# Altium project testrack_backplane_passive.PrjPcb
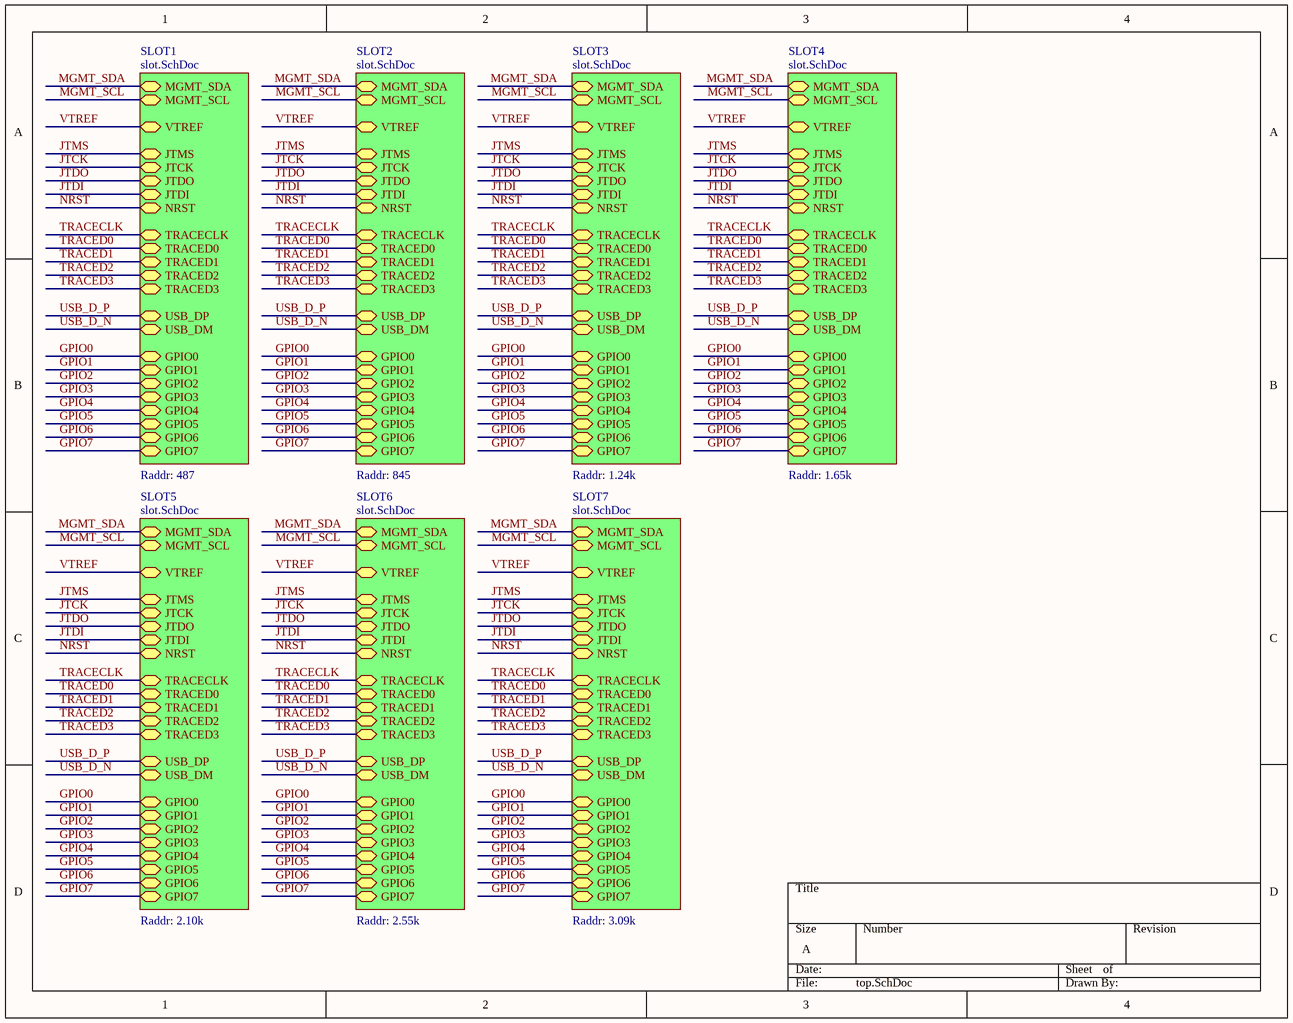
[diagram p0: top.SchDoc]
2 sheets, 14 parts. Net scope: hierarchical (ports join the sheet entries above them; power ports are global).
Board file: testrack_backplane_passive.PcbDoc
Sheets:
  top.SchDoc
    SLOT1 = slot.SchDoc
    SLOT2 = slot.SchDoc
    SLOT3 = slot.SchDoc
    SLOT4 = slot.SchDoc
    SLOT5 = slot.SchDoc
    SLOT6 = slot.SchDoc
    SLOT7 = slot.SchDoc

## Sheet top.SchDoc
size A

### Sub-sheets
SLOT1 = slot.SchDoc: JTCK (bidir), GPIO1 (bidir), GPIO0 (bidir), TRACED0 (bidir), GPIO6 (bidir), USB_DP (bidir), NRST (bidir), USB_DM (bidir), MGMT_SDA (bidir), GPIO5 (bidir), JTDO (bidir), GPIO7 (bidir), GPIO3 (bidir), VTREF (bidir), TRACED2 (bidir), GPIO2 (bidir), TRACECLK (bidir), GPIO4 (bidir), MGMT_SCL (bidir), JTMS (bidir), TRACED3 (bidir), TRACED1 (bidir), JTDI (bidir)  | Raddr: 487
SLOT2 = slot.SchDoc: JTCK (bidir), GPIO1 (bidir), GPIO0 (bidir), TRACED0 (bidir), GPIO6 (bidir), USB_DP (bidir), NRST (bidir), USB_DM (bidir), MGMT_SDA (bidir), GPIO5 (bidir), JTDO (bidir), GPIO7 (bidir), GPIO3 (bidir), VTREF (bidir), TRACED2 (bidir), GPIO2 (bidir), TRACECLK (bidir), GPIO4 (bidir), MGMT_SCL (bidir), JTMS (bidir), TRACED3 (bidir), TRACED1 (bidir), JTDI (bidir)  | Raddr: 845
SLOT3 = slot.SchDoc: JTCK (bidir), GPIO1 (bidir), GPIO0 (bidir), TRACED0 (bidir), GPIO6 (bidir), USB_DP (bidir), NRST (bidir), USB_DM (bidir), MGMT_SDA (bidir), GPIO5 (bidir), JTDO (bidir), GPIO7 (bidir), GPIO3 (bidir), VTREF (bidir), TRACED2 (bidir), GPIO2 (bidir), TRACECLK (bidir), GPIO4 (bidir), MGMT_SCL (bidir), JTMS (bidir), TRACED3 (bidir), TRACED1 (bidir), JTDI (bidir)  | Raddr: 1.24k
SLOT4 = slot.SchDoc: JTCK (bidir), GPIO1 (bidir), GPIO0 (bidir), TRACED0 (bidir), GPIO6 (bidir), USB_DP (bidir), NRST (bidir), USB_DM (bidir), MGMT_SDA (bidir), GPIO5 (bidir), JTDO (bidir), GPIO7 (bidir), GPIO3 (bidir), VTREF (bidir), TRACED2 (bidir), GPIO2 (bidir), TRACECLK (bidir), GPIO4 (bidir), MGMT_SCL (bidir), JTMS (bidir), TRACED3 (bidir), TRACED1 (bidir), JTDI (bidir)  | Raddr: 1.65k
SLOT5 = slot.SchDoc: JTCK (bidir), GPIO1 (bidir), GPIO0 (bidir), TRACED0 (bidir), GPIO6 (bidir), USB_DP (bidir), NRST (bidir), USB_DM (bidir), MGMT_SDA (bidir), GPIO5 (bidir), JTDO (bidir), GPIO7 (bidir), GPIO3 (bidir), VTREF (bidir), TRACED2 (bidir), GPIO2 (bidir), TRACECLK (bidir), GPIO4 (bidir), MGMT_SCL (bidir), JTMS (bidir), TRACED3 (bidir), TRACED1 (bidir), JTDI (bidir)  | Raddr: 2.10k
SLOT6 = slot.SchDoc: JTCK (bidir), GPIO1 (bidir), GPIO0 (bidir), TRACED0 (bidir), GPIO6 (bidir), USB_DP (bidir), NRST (bidir), USB_DM (bidir), MGMT_SDA (bidir), GPIO5 (bidir), JTDO (bidir), GPIO7 (bidir), GPIO3 (bidir), VTREF (bidir), TRACED2 (bidir), GPIO2 (bidir), TRACECLK (bidir), GPIO4 (bidir), MGMT_SCL (bidir), JTMS (bidir), TRACED3 (bidir), TRACED1 (bidir), JTDI (bidir)  | Raddr: 2.55k
SLOT7 = slot.SchDoc: JTCK (bidir), GPIO1 (bidir), GPIO0 (bidir), TRACED0 (bidir), GPIO6 (bidir), USB_DP (bidir), NRST (bidir), USB_DM (bidir), MGMT_SDA (bidir), GPIO5 (bidir), JTDO (bidir), GPIO7 (bidir), GPIO3 (bidir), VTREF (bidir), TRACED2 (bidir), GPIO2 (bidir), TRACECLK (bidir), GPIO4 (bidir), MGMT_SCL (bidir), JTMS (bidir), TRACED3 (bidir), TRACED1 (bidir), JTDI (bidir)  | Raddr: 3.09k

### Nets
GPIO0: sheet SLOT1/GPIO0, sheet SLOT2/GPIO0, sheet SLOT3/GPIO0, sheet SLOT4/GPIO0, sheet SLOT5/GPIO0, sheet SLOT6/GPIO0, sheet SLOT7/GPIO0
GPIO1: sheet SLOT1/GPIO1, sheet SLOT2/GPIO1, sheet SLOT3/GPIO1, sheet SLOT4/GPIO1, sheet SLOT5/GPIO1, sheet SLOT6/GPIO1, sheet SLOT7/GPIO1
GPIO2: sheet SLOT1/GPIO2, sheet SLOT2/GPIO2, sheet SLOT3/GPIO2, sheet SLOT4/GPIO2, sheet SLOT5/GPIO2, sheet SLOT6/GPIO2, sheet SLOT7/GPIO2
GPIO3: sheet SLOT1/GPIO3, sheet SLOT2/GPIO3, sheet SLOT3/GPIO3, sheet SLOT4/GPIO3, sheet SLOT5/GPIO3, sheet SLOT6/GPIO3, sheet SLOT7/GPIO3
GPIO4: sheet SLOT1/GPIO4, sheet SLOT2/GPIO4, sheet SLOT3/GPIO4, sheet SLOT4/GPIO4, sheet SLOT5/GPIO4, sheet SLOT6/GPIO4, sheet SLOT7/GPIO4
GPIO5: sheet SLOT1/GPIO5, sheet SLOT2/GPIO5, sheet SLOT3/GPIO5, sheet SLOT4/GPIO5, sheet SLOT5/GPIO5, sheet SLOT6/GPIO5, sheet SLOT7/GPIO5
GPIO6: sheet SLOT1/GPIO6, sheet SLOT2/GPIO6, sheet SLOT3/GPIO6, sheet SLOT4/GPIO6, sheet SLOT5/GPIO6, sheet SLOT6/GPIO6, sheet SLOT7/GPIO6
GPIO7: sheet SLOT1/GPIO7, sheet SLOT2/GPIO7, sheet SLOT3/GPIO7, sheet SLOT4/GPIO7, sheet SLOT5/GPIO7, sheet SLOT6/GPIO7, sheet SLOT7/GPIO7
JTCK: sheet SLOT1/JTCK, sheet SLOT2/JTCK, sheet SLOT3/JTCK, sheet SLOT4/JTCK, sheet SLOT5/JTCK, sheet SLOT6/JTCK, sheet SLOT7/JTCK
JTDI: sheet SLOT1/JTDI, sheet SLOT2/JTDI, sheet SLOT3/JTDI, sheet SLOT4/JTDI, sheet SLOT5/JTDI, sheet SLOT6/JTDI, sheet SLOT7/JTDI
JTDO: sheet SLOT1/JTDO, sheet SLOT2/JTDO, sheet SLOT3/JTDO, sheet SLOT4/JTDO, sheet SLOT5/JTDO, sheet SLOT6/JTDO, sheet SLOT7/JTDO
JTMS: sheet SLOT1/JTMS, sheet SLOT2/JTMS, sheet SLOT3/JTMS, sheet SLOT4/JTMS, sheet SLOT5/JTMS, sheet SLOT6/JTMS, sheet SLOT7/JTMS
MGMT_SCL: sheet SLOT1/MGMT_SCL, sheet SLOT2/MGMT_SCL, sheet SLOT3/MGMT_SCL, sheet SLOT4/MGMT_SCL, sheet SLOT5/MGMT_SCL, sheet SLOT6/MGMT_SCL, sheet SLOT7/MGMT_SCL
MGMT_SDA: sheet SLOT1/MGMT_SDA, sheet SLOT2/MGMT_SDA, sheet SLOT3/MGMT_SDA, sheet SLOT4/MGMT_SDA, sheet SLOT5/MGMT_SDA, sheet SLOT6/MGMT_SDA, sheet SLOT7/MGMT_SDA
NRST: sheet SLOT1/NRST, sheet SLOT2/NRST, sheet SLOT3/NRST, sheet SLOT4/NRST, sheet SLOT5/NRST, sheet SLOT6/NRST, sheet SLOT7/NRST
TRACECLK: sheet SLOT1/TRACECLK, sheet SLOT2/TRACECLK, sheet SLOT3/TRACECLK, sheet SLOT4/TRACECLK, sheet SLOT5/TRACECLK, sheet SLOT6/TRACECLK, sheet SLOT7/TRACECLK
TRACED0: sheet SLOT1/TRACED0, sheet SLOT2/TRACED0, sheet SLOT3/TRACED0, sheet SLOT4/TRACED0, sheet SLOT5/TRACED0, sheet SLOT6/TRACED0, sheet SLOT7/TRACED0
TRACED1: sheet SLOT1/TRACED1, sheet SLOT2/TRACED1, sheet SLOT3/TRACED1, sheet SLOT4/TRACED1, sheet SLOT5/TRACED1, sheet SLOT6/TRACED1, sheet SLOT7/TRACED1
TRACED2: sheet SLOT1/TRACED2, sheet SLOT2/TRACED2, sheet SLOT3/TRACED2, sheet SLOT4/TRACED2, sheet SLOT5/TRACED2, sheet SLOT6/TRACED2, sheet SLOT7/TRACED2
TRACED3: sheet SLOT1/TRACED3, sheet SLOT2/TRACED3, sheet SLOT3/TRACED3, sheet SLOT4/TRACED3, sheet SLOT5/TRACED3, sheet SLOT6/TRACED3, sheet SLOT7/TRACED3
USB_D_N: sheet SLOT1/USB_DM, sheet SLOT2/USB_DM, sheet SLOT3/USB_DM, sheet SLOT4/USB_DM, sheet SLOT5/USB_DM, sheet SLOT6/USB_DM, sheet SLOT7/USB_DM
USB_D_P: sheet SLOT1/USB_DP, sheet SLOT2/USB_DP, sheet SLOT3/USB_DP, sheet SLOT4/USB_DP, sheet SLOT5/USB_DP, sheet SLOT6/USB_DP, sheet SLOT7/USB_DP
VTREF: sheet SLOT1/VTREF, sheet SLOT2/VTREF, sheet SLOT3/VTREF, sheet SLOT4/VTREF, sheet SLOT5/VTREF, sheet SLOT6/VTREF, sheet SLOT7/VTREF

## Sheet slot.SchDoc
size A
Used 7 times, as channels SLOT1, SLOT2, SLOT3, SLOT4, SLOT5, SLOT6, SLOT7. Parts and nets are listed once, with the designators drawn on the sheet.
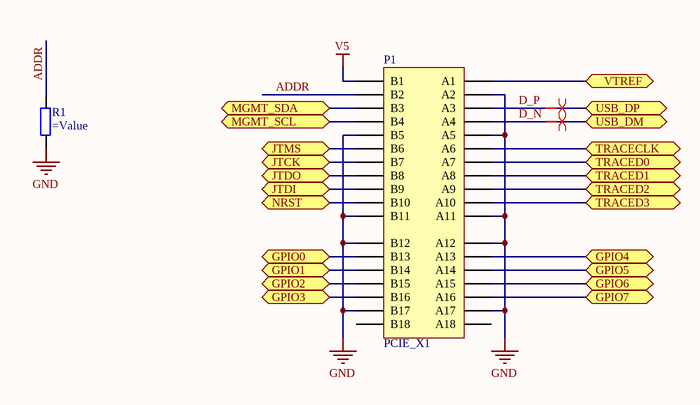
[diagram p1: slot.SchDoc]

### Parts
P1  PCIE_X1  [PCIE_X1_SMT]
R1  (no value)  [0402]

### Ports
GPIO0 (bidir), GPIO1 (bidir), GPIO2 (bidir), GPIO3 (bidir), GPIO4 (bidir), GPIO5 (bidir), GPIO6 (bidir), GPIO7 (bidir), JTCK (bidir), JTDI (bidir), JTDO (bidir), JTMS (bidir), MGMT_SCL (bidir), MGMT_SDA (bidir), NRST (bidir), TRACECLK (bidir), TRACED0 (bidir), TRACED1 (bidir), TRACED2 (bidir), TRACED3 (bidir), USB_DM (bidir), USB_DP (bidir), VTREF (bidir)

### Nets
GND: P1.A2 P1.A5 P1.A11 P1.A12 P1.A17 P1.B5 P1.B11 P1.B12 P1.B17 R1.1
V5: P1.B1
ADDR: P1.B2 R1.2
D_N: P1.A4 ; port USB_DM
D_P: P1.A3 ; port USB_DP
GPIO0: P1.B13 ; port GPIO0
GPIO1: P1.B14 ; port GPIO1
GPIO2: P1.B15 ; port GPIO2
GPIO3: P1.B16 ; port GPIO3
GPIO4: P1.A13 ; port GPIO4
GPIO5: P1.A14 ; port GPIO5
GPIO6: P1.A15 ; port GPIO6
GPIO7: P1.A16 ; port GPIO7
JTCK: P1.B7 ; port JTCK
JTDI: P1.B9 ; port JTDI
JTDO: P1.B8 ; port JTDO
JTMS: P1.B6 ; port JTMS
MGMT_SCL: P1.B4 ; port MGMT_SCL
MGMT_SDA: P1.B3 ; port MGMT_SDA
NRST: P1.B10 ; port NRST
TRACECLK: P1.A6 ; port TRACECLK
TRACED0: P1.A7 ; port TRACED0
TRACED1: P1.A8 ; port TRACED1
TRACED2: P1.A9 ; port TRACED2
TRACED3: P1.A10 ; port TRACED3
VTREF: P1.A1 ; port VTREF

Not connected (* = marked no-connect by the designer): P1 A18 B18

### Channels
SLOT1: designators end in _SLOT1; ports GPIO0=GPIO0 GPIO1=GPIO1 GPIO2=GPIO2 GPIO3=GPIO3 GPIO4=GPIO4 GPIO5=GPIO5 GPIO6=GPIO6 GPIO7=GPIO7 JTCK=JTCK JTDI=JTDI JTDO=JTDO JTMS=JTMS MGMT_SCL=MGMT_SCL MGMT_SDA=MGMT_SDA NRST=NRST TRACECLK=TRACECLK TRACED0=TRACED0 TRACED1=TRACED1 TRACED2=TRACED2 TRACED3=TRACED3 USB_DM=USB_D_N USB_DP=USB_D_P VTREF=VTREF
SLOT2: designators end in _SLOT2; ports GPIO0=GPIO0 GPIO1=GPIO1 GPIO2=GPIO2 GPIO3=GPIO3 GPIO4=GPIO4 GPIO5=GPIO5 GPIO6=GPIO6 GPIO7=GPIO7 JTCK=JTCK JTDI=JTDI JTDO=JTDO JTMS=JTMS MGMT_SCL=MGMT_SCL MGMT_SDA=MGMT_SDA NRST=NRST TRACECLK=TRACECLK TRACED0=TRACED0 TRACED1=TRACED1 TRACED2=TRACED2 TRACED3=TRACED3 USB_DM=USB_D_N USB_DP=USB_D_P VTREF=VTREF
SLOT3: designators end in _SLOT3; ports GPIO0=GPIO0 GPIO1=GPIO1 GPIO2=GPIO2 GPIO3=GPIO3 GPIO4=GPIO4 GPIO5=GPIO5 GPIO6=GPIO6 GPIO7=GPIO7 JTCK=JTCK JTDI=JTDI JTDO=JTDO JTMS=JTMS MGMT_SCL=MGMT_SCL MGMT_SDA=MGMT_SDA NRST=NRST TRACECLK=TRACECLK TRACED0=TRACED0 TRACED1=TRACED1 TRACED2=TRACED2 TRACED3=TRACED3 USB_DM=USB_D_N USB_DP=USB_D_P VTREF=VTREF
SLOT4: designators end in _SLOT4; ports GPIO0=GPIO0 GPIO1=GPIO1 GPIO2=GPIO2 GPIO3=GPIO3 GPIO4=GPIO4 GPIO5=GPIO5 GPIO6=GPIO6 GPIO7=GPIO7 JTCK=JTCK JTDI=JTDI JTDO=JTDO JTMS=JTMS MGMT_SCL=MGMT_SCL MGMT_SDA=MGMT_SDA NRST=NRST TRACECLK=TRACECLK TRACED0=TRACED0 TRACED1=TRACED1 TRACED2=TRACED2 TRACED3=TRACED3 USB_DM=USB_D_N USB_DP=USB_D_P VTREF=VTREF
SLOT5: designators end in _SLOT5; ports GPIO0=GPIO0 GPIO1=GPIO1 GPIO2=GPIO2 GPIO3=GPIO3 GPIO4=GPIO4 GPIO5=GPIO5 GPIO6=GPIO6 GPIO7=GPIO7 JTCK=JTCK JTDI=JTDI JTDO=JTDO JTMS=JTMS MGMT_SCL=MGMT_SCL MGMT_SDA=MGMT_SDA NRST=NRST TRACECLK=TRACECLK TRACED0=TRACED0 TRACED1=TRACED1 TRACED2=TRACED2 TRACED3=TRACED3 USB_DM=USB_D_N USB_DP=USB_D_P VTREF=VTREF
SLOT6: designators end in _SLOT6; ports GPIO0=GPIO0 GPIO1=GPIO1 GPIO2=GPIO2 GPIO3=GPIO3 GPIO4=GPIO4 GPIO5=GPIO5 GPIO6=GPIO6 GPIO7=GPIO7 JTCK=JTCK JTDI=JTDI JTDO=JTDO JTMS=JTMS MGMT_SCL=MGMT_SCL MGMT_SDA=MGMT_SDA NRST=NRST TRACECLK=TRACECLK TRACED0=TRACED0 TRACED1=TRACED1 TRACED2=TRACED2 TRACED3=TRACED3 USB_DM=USB_D_N USB_DP=USB_D_P VTREF=VTREF
SLOT7: designators end in _SLOT7; ports GPIO0=GPIO0 GPIO1=GPIO1 GPIO2=GPIO2 GPIO3=GPIO3 GPIO4=GPIO4 GPIO5=GPIO5 GPIO6=GPIO6 GPIO7=GPIO7 JTCK=JTCK JTDI=JTDI JTDO=JTDO JTMS=JTMS MGMT_SCL=MGMT_SCL MGMT_SDA=MGMT_SDA NRST=NRST TRACECLK=TRACECLK TRACED0=TRACED0 TRACED1=TRACED1 TRACED2=TRACED2 TRACED3=TRACED3 USB_DM=USB_D_N USB_DP=USB_D_P VTREF=VTREF

### Layout directives
differential pair: USB_D_N, USB_D_P

### Library data of the parts
R1 = Resistor: Value: =Raddr

## Nets that join several sheets
GND: SLOT1 (10 pins), SLOT2 (10 pins), SLOT3 (10 pins), SLOT4 (10 pins), SLOT5 (10 pins), SLOT6 (10 pins), SLOT7 (10 pins)
V5: SLOT1 (P1_SLOT1.B1), SLOT2 (P1_SLOT2.B1), SLOT3 (P1_SLOT3.B1), SLOT4 (P1_SLOT4.B1), SLOT5 (P1_SLOT5.B1), SLOT6 (P1_SLOT6.B1), SLOT7 (P1_SLOT7.B1)
GPIO0: SLOT1 (P1_SLOT1.B13), SLOT2 (P1_SLOT2.B13), SLOT3 (P1_SLOT3.B13), SLOT4 (P1_SLOT4.B13), SLOT5 (P1_SLOT5.B13), SLOT6 (P1_SLOT6.B13), SLOT7 (P1_SLOT7.B13)
GPIO1: SLOT1 (P1_SLOT1.B14), SLOT2 (P1_SLOT2.B14), SLOT3 (P1_SLOT3.B14), SLOT4 (P1_SLOT4.B14), SLOT5 (P1_SLOT5.B14), SLOT6 (P1_SLOT6.B14), SLOT7 (P1_SLOT7.B14)
GPIO2: SLOT1 (P1_SLOT1.B15), SLOT2 (P1_SLOT2.B15), SLOT3 (P1_SLOT3.B15), SLOT4 (P1_SLOT4.B15), SLOT5 (P1_SLOT5.B15), SLOT6 (P1_SLOT6.B15), SLOT7 (P1_SLOT7.B15)
GPIO3: SLOT1 (P1_SLOT1.B16), SLOT2 (P1_SLOT2.B16), SLOT3 (P1_SLOT3.B16), SLOT4 (P1_SLOT4.B16), SLOT5 (P1_SLOT5.B16), SLOT6 (P1_SLOT6.B16), SLOT7 (P1_SLOT7.B16)
GPIO4: SLOT1 (P1_SLOT1.A13), SLOT2 (P1_SLOT2.A13), SLOT3 (P1_SLOT3.A13), SLOT4 (P1_SLOT4.A13), SLOT5 (P1_SLOT5.A13), SLOT6 (P1_SLOT6.A13), SLOT7 (P1_SLOT7.A13)
GPIO5: SLOT1 (P1_SLOT1.A14), SLOT2 (P1_SLOT2.A14), SLOT3 (P1_SLOT3.A14), SLOT4 (P1_SLOT4.A14), SLOT5 (P1_SLOT5.A14), SLOT6 (P1_SLOT6.A14), SLOT7 (P1_SLOT7.A14)
GPIO6: SLOT1 (P1_SLOT1.A15), SLOT2 (P1_SLOT2.A15), SLOT3 (P1_SLOT3.A15), SLOT4 (P1_SLOT4.A15), SLOT5 (P1_SLOT5.A15), SLOT6 (P1_SLOT6.A15), SLOT7 (P1_SLOT7.A15)
GPIO7: SLOT1 (P1_SLOT1.A16), SLOT2 (P1_SLOT2.A16), SLOT3 (P1_SLOT3.A16), SLOT4 (P1_SLOT4.A16), SLOT5 (P1_SLOT5.A16), SLOT6 (P1_SLOT6.A16), SLOT7 (P1_SLOT7.A16)
JTCK: SLOT1 (P1_SLOT1.B7), SLOT2 (P1_SLOT2.B7), SLOT3 (P1_SLOT3.B7), SLOT4 (P1_SLOT4.B7), SLOT5 (P1_SLOT5.B7), SLOT6 (P1_SLOT6.B7), SLOT7 (P1_SLOT7.B7)
JTDI: SLOT1 (P1_SLOT1.B9), SLOT2 (P1_SLOT2.B9), SLOT3 (P1_SLOT3.B9), SLOT4 (P1_SLOT4.B9), SLOT5 (P1_SLOT5.B9), SLOT6 (P1_SLOT6.B9), SLOT7 (P1_SLOT7.B9)
JTDO: SLOT1 (P1_SLOT1.B8), SLOT2 (P1_SLOT2.B8), SLOT3 (P1_SLOT3.B8), SLOT4 (P1_SLOT4.B8), SLOT5 (P1_SLOT5.B8), SLOT6 (P1_SLOT6.B8), SLOT7 (P1_SLOT7.B8)
JTMS: SLOT1 (P1_SLOT1.B6), SLOT2 (P1_SLOT2.B6), SLOT3 (P1_SLOT3.B6), SLOT4 (P1_SLOT4.B6), SLOT5 (P1_SLOT5.B6), SLOT6 (P1_SLOT6.B6), SLOT7 (P1_SLOT7.B6)
MGMT_SCL: SLOT1 (P1_SLOT1.B4), SLOT2 (P1_SLOT2.B4), SLOT3 (P1_SLOT3.B4), SLOT4 (P1_SLOT4.B4), SLOT5 (P1_SLOT5.B4), SLOT6 (P1_SLOT6.B4), SLOT7 (P1_SLOT7.B4)
MGMT_SDA: SLOT1 (P1_SLOT1.B3), SLOT2 (P1_SLOT2.B3), SLOT3 (P1_SLOT3.B3), SLOT4 (P1_SLOT4.B3), SLOT5 (P1_SLOT5.B3), SLOT6 (P1_SLOT6.B3), SLOT7 (P1_SLOT7.B3)
NRST: SLOT1 (P1_SLOT1.B10), SLOT2 (P1_SLOT2.B10), SLOT3 (P1_SLOT3.B10), SLOT4 (P1_SLOT4.B10), SLOT5 (P1_SLOT5.B10), SLOT6 (P1_SLOT6.B10), SLOT7 (P1_SLOT7.B10)
TRACECLK: SLOT1 (P1_SLOT1.A6), SLOT2 (P1_SLOT2.A6), SLOT3 (P1_SLOT3.A6), SLOT4 (P1_SLOT4.A6), SLOT5 (P1_SLOT5.A6), SLOT6 (P1_SLOT6.A6), SLOT7 (P1_SLOT7.A6)
TRACED0: SLOT1 (P1_SLOT1.A7), SLOT2 (P1_SLOT2.A7), SLOT3 (P1_SLOT3.A7), SLOT4 (P1_SLOT4.A7), SLOT5 (P1_SLOT5.A7), SLOT6 (P1_SLOT6.A7), SLOT7 (P1_SLOT7.A7)
TRACED1: SLOT1 (P1_SLOT1.A8), SLOT2 (P1_SLOT2.A8), SLOT3 (P1_SLOT3.A8), SLOT4 (P1_SLOT4.A8), SLOT5 (P1_SLOT5.A8), SLOT6 (P1_SLOT6.A8), SLOT7 (P1_SLOT7.A8)
TRACED2: SLOT1 (P1_SLOT1.A9), SLOT2 (P1_SLOT2.A9), SLOT3 (P1_SLOT3.A9), SLOT4 (P1_SLOT4.A9), SLOT5 (P1_SLOT5.A9), SLOT6 (P1_SLOT6.A9), SLOT7 (P1_SLOT7.A9)
TRACED3: SLOT1 (P1_SLOT1.A10), SLOT2 (P1_SLOT2.A10), SLOT3 (P1_SLOT3.A10), SLOT4 (P1_SLOT4.A10), SLOT5 (P1_SLOT5.A10), SLOT6 (P1_SLOT6.A10), SLOT7 (P1_SLOT7.A10)
USB_D_N: SLOT1 (P1_SLOT1.A4), SLOT2 (P1_SLOT2.A4), SLOT3 (P1_SLOT3.A4), SLOT4 (P1_SLOT4.A4), SLOT5 (P1_SLOT5.A4), SLOT6 (P1_SLOT6.A4), SLOT7 (P1_SLOT7.A4)
USB_D_P: SLOT1 (P1_SLOT1.A3), SLOT2 (P1_SLOT2.A3), SLOT3 (P1_SLOT3.A3), SLOT4 (P1_SLOT4.A3), SLOT5 (P1_SLOT5.A3), SLOT6 (P1_SLOT6.A3), SLOT7 (P1_SLOT7.A3)
VTREF: SLOT1 (P1_SLOT1.A1), SLOT2 (P1_SLOT2.A1), SLOT3 (P1_SLOT3.A1), SLOT4 (P1_SLOT4.A1), SLOT5 (P1_SLOT5.A1), SLOT6 (P1_SLOT6.A1), SLOT7 (P1_SLOT7.A1)